# EasyEDA Pro project USB_FLARM_UPDATER.eprj, board PCB1
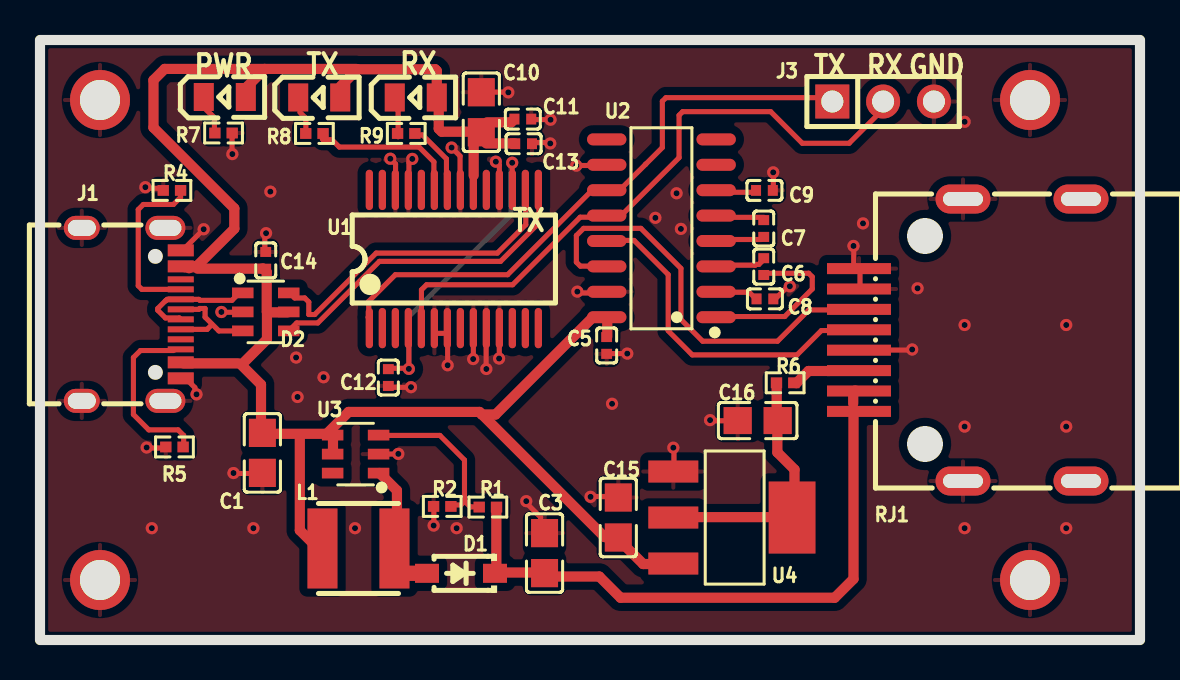
[diagram p1: board, top side]
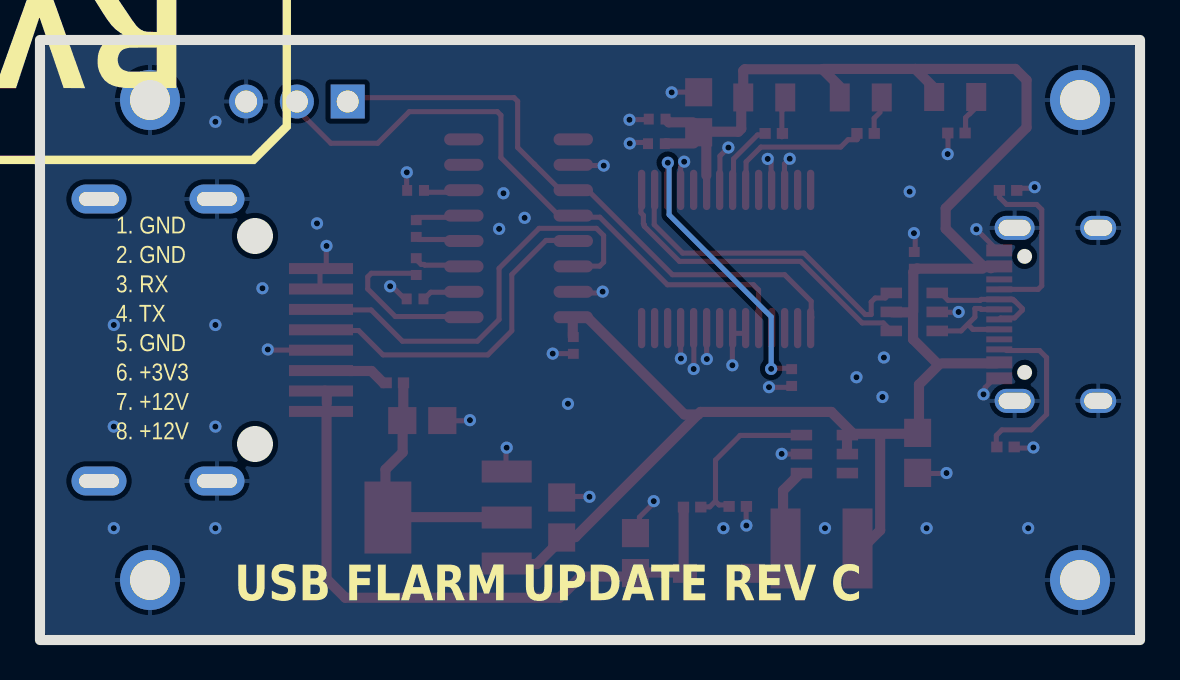
[diagram p2: board, bottom side, seen from below]

Outline 55 x 30 mm; copper layers: Top Layer, Bottom Layer. Coordinates in mm from the lower left corner of the outline.
Outline path: rectangle 0,30 55,0
Stack: Top Layer 0.035mm / Dielectric1 1.51mm FR4 er 4.5 / Bottom Layer 0.035mm

## Design rules (mm)
net VUSB: Power
net V12_OUT: Power_12V
net UD+: DP1
net UD-: DP1
net UD_IN+: DP2
net UD_IN-: DP2
template: Custom Config
spacing copperThickness1oz (default): track to track 0.102, other pairs 0.152 to 0.3
spacing copperThickness2oz: track to track 0.203, other pairs 0.152 to 0.3
track width copperThickness1oz (default): min 0.127, default 0.254, max 2.54
track width copperThickness2oz: min 0.203, default 0.254, max 2.54
track width min20mil: min 0.508, default 0.508, max 2.54
track width min15mil: min 0.381, default 0.381, max 2.54
differential pair differentialPair (default): width min 0.127, default 0.254, max 2.54; gap min 0.152, default 0.152
via viaSize (default): diameter min 0.5, default 0.61, max 10; hole min 0.3, default 0.305, max 6.3
net class Power uses min20mil
net class Power_12V uses min15mil
net VUSB uses min20mil
net V12_OUT uses min15mil

## Placement (name value [footprint] x y rotation side)
C1  22uF  [C0805]  11.12 9.36 270 top
C3  22uF  [C0805]  25.23 4.34 90 top
C5  100nF  [C0402]  28.33 14.73 90 top
C6  100nF  [C0402]  36.19 18.67 90 top
C7  100nF  [C0402]  36.19 20.57 90 top
C8  100nF  [C0402]  36.25 17.06 0 top
C9  100nF  [C0402]  36.22 22.48 0 top
C10  4.7uF  [C0805]  22.07 26.39 270 top
C11  100nF  [C0402]  24.14 26.05 180 top
C12  100nF  [C0402]  17.42 13.12 270 top
C13  100nF  [C0402]  24.18 24.81 180 top
C14  100nF  [C0402]  11.29 18.98 90 top
C15  22uF  [C0805]  28.91 6.13 270 top
C16  22uF  [C0805]  35.88 10.97 0 top
D1  B5819W SL  [SOD-123_L2.7-W1.6-LS3.7-RD-1]  21.05 3.33 180 top
D2  USBLC6-2SC6  [SOT-23-6_L2.9-W1.6-P0.95-LS2.8-BL]  11.29 16.4 270 top
J1  TYPE-C-31-M-12  [USB-C_SMD-TYPE-C-31-M-12_1]  4.56 16.28 270 top
J3  -  [HDR-TH_3P-P2.54-V-M]  42.16 26.92 0 top
L1  22uH  [IND-SMD_L4.0-W4.0_LQH44PN2R2MP0L]  15.92 4.58 180 top
LED1  KT-0805G  [LED0805-R-RD]  9.24 27.15 0 top
LED2  KT-0805Y  [LED0805-R-RD]  13.96 27.13 0 top
LED3  KT-0805Y  [LED0805-R-RD]  18.79 27.13 0 top
NOREF  -  [Pad_e1500]  49.5 3 0 top
NOREF#2  -  [Pad_e961]  3 3 0 top
NOREF#3  -  [Pad_e1501]  49.5 27 0 top
NOREF#4  -  [Pad_e752]  3 27 0 top
R1  100kΩ  [R0402]  22.39 6.65 0 top
R2  5.1kΩ  [R0402]  20.11 6.68 0 top
R4  5.1kΩ  [R0402]  6.6 22.48 0 top
R5  5.1kΩ  [R0402]  6.72 9.65 0 top
R6  10Ω  [R0402]  37.26 12.86 0 top
R7  680Ω  [R0402]  9.18 25.35 0 top
R8  680Ω  [R0402]  13.72 25.33 0 top
R9  680Ω  [R0402]  18.31 25.33 0 top
RJ1  RJ-064-1  [CONN-SMD_RJ-064]  46.5 15 90 top
U1  FT232RL-REEL  [SSOP-28_L10.2-W5.3-P0.65-LS7.8-BL]  20.69 19.05 0 top
U2  MAX3232CSE+T  [SOIC-16_L9.9-W3.9-P1.27-LS6.0-BL]  31.07 20.59 90 top
U3  MT3608  [SOT-23-6_L2.9-W1.6-P0.95-LS2.8-BL]  15.78 9.3 90 top
U4  AMS1117-3.3  [SOT-223-3_L6.5-W3.4-P2.30-LS7.0-BR]  34.63 6.12 180 top

## Footprints (pads in the part's own frame, mm; a bottom-side part is the same pattern mirrored in y, then rotated)
C0402
  rect 0.5x0.54 smd: 1(-0.42,0) 2(0.42,0)
C0805
  rect 1.41x1.35 smd: 1(-1,0) 2(1,0)
CONN-SMD_RJ-064
  rect 0.55x3.2 smd: 1(3.57,5.55) 2(2.55,5.55) 3(1.53,5.55) 4(0.51,5.55) 5(-0.51,5.55) 6(-1.53,5.55) 7(-2.55,5.55) 8(-3.57,5.55)
  oval 1.45x2.75 hole 0.7x2: 9(7.05,0.35) 10(-7.05,0.35) 11(7.05,-5.55) 12(-7.05,-5.55)
HDR-TH_3P-P2.54-V-M
  rect 1.7x1.7 hole 1.1: 1(-2.54,0)
  round 1.7 hole 1.1: 2(0,0) 3(2.54,0)
IND-SMD_L4.0-W4.0_LQH44PN2R2MP0L
  rect 1.5x4 smd: 1(-1.8,0) 2(1.8,0)
LED0805-R-RD
  rect 1x1.399 smd: 1(1.05,0) 2(-1.05,0)
Pad_e752
  round 3 hole 2: 1(0,0)
Pad_e961
  round 3 hole 2: 1(0,0)
Pad_e1500
  round 3 hole 2: 1(0,0)
Pad_e1501
  round 3 hole 2: 1(0,0)
R0402
  rect 0.566x0.54 smd: 1(-0.433,0) 2(0.433,0)
SOD-123_L2.7-W1.6-LS3.7-RD-1
  rect 1.2x0.95 smd: 1(-1.7,0) 2(1.7,0)
SOIC-16_L9.9-W3.9-P1.27-LS6.0-BL
  oval 0.602x1.971 smd: 1(-4.445,-2.736) 2(-3.175,-2.736) 3(-1.905,-2.736) 4(-0.635,-2.736) 5(0.635,-2.736) 6(1.905,-2.736) 7(3.175,-2.736) 8(4.445,-2.736) 9(4.445,2.736) 10(3.175,2.736) 11(1.905,2.736) 12(0.635,2.736) 13(-0.635,2.736) 14(-1.905,2.736) 15(-3.175,2.736) 16(-4.445,2.736)
SOT-23-6_L2.9-W1.6-P0.95-LS2.8-BL
  rect 0.532x1.072 smd: 1(-0.95,-1.149) 2(0,-1.149) 3(0.95,-1.149) 4(0.95,1.149) 5(0,1.149) 6(-0.95,1.149)
SOT-223-3_L6.5-W3.4-P2.30-LS7.0-BR
  rect 2.5x1.1 smd: 1(2.97,-2.3) 2(2.97,0) 3(2.97,2.3)
  rect 2.34x3.6 smd: 4(-2.97,0)
SSOP-28_L10.2-W5.3-P0.65-LS7.8-BL
  oval 0.364x2.015 smd: 1(-4.225,-3.455) 2(-3.575,-3.455) 3(-2.925,-3.455) 4(-2.275,-3.455) 5(-1.625,-3.455) 6(-0.975,-3.455) 7(-0.325,-3.455) 8(0.325,-3.455) 9(0.975,-3.455) 10(1.625,-3.455) 11(2.275,-3.455) 12(2.925,-3.455) 13(3.575,-3.455) 14(4.225,-3.455) 15(4.225,3.455) 16(3.575,3.455) 17(2.925,3.455) 18(2.275,3.455) 19(1.625,3.455) 20(0.975,3.455) 21(0.325,3.455) 22(-0.325,3.455) 23(-0.975,3.455) 24(-1.625,3.455) 25(-2.275,3.455) 26(-2.925,3.455) 27(-3.575,3.455) 28(-4.225,3.455)
USB-C_SMD-TYPE-C-31-M-12_1
  oval 1.2x2 hole 0.8x1.6: 1(4.325,1.706) 4(-4.325,1.706)
  oval 1.2x1.8 hole 0.8x1.4: 2(4.325,-2.474) 3(-4.325,-2.474)
  custom 0.6x1.3 smd: A1B12(-3.2,2.474) A4B9(-2.4,2.474) B1A12(3.2,2.474) B4A9(2.401,2.474)
  rect 0.3x1.3 smd: A5(-1.25,2.474) A6(-0.25,2.474) A7(0.25,2.474) A8(1.25,2.474) B5(1.75,2.474) B6(0.75,2.474) B7(-0.75,2.474) B8(-1.75,2.474)

## Nets
As in the schematic, except:
GND: C1.2 C3.2 C5.1 C8.2 C9.2 C10.1 C11.1 C12.2 C13.1 C14.2 C15.1 C16.1 D2.2 J1.1 J1.2 J1.3 J1.4 J1.A1B12 J1.B1A12 J3.3 NOREF.1 NOREF#2.1 NOREF#3.1 NOREF#4.1 R2.1 R4.1 R5.1 R7.2 RJ1.1 RJ1.2 RJ1.5 RJ1.9 RJ1.10 U1.6 U1.7 U1.9 U1.10 U1.11 U1.18 U1.21 U1.25 U1.26 U2.10 U2.15 U3.2 U4.1

Pads without a net: J1 A8 B8; RJ1 11 12; U1 2 3 8 12 13 14 19 24 27 28; U2 7 8 9; U3 6

## Via types
v1: diameter 0.61, hole 0.305, Top Layer to Bottom Layer, 56 vias

## Routing (per net, layer and track width the routed paths; a pad name or vN(x,y) marks a point on that pad's centre or on a via; arc(x,y) is an arc through that point)
GND: length 34.3
  Top Layer w0.254: 9.6,24.35 9.6,25.12 9.68,25.19 ; v1(17.51,24.06) 17.78,23.8 17.78,23.16 ; 26.79,23.72 27.76,23.72 27.83,23.79 ; 22.84,23.86 22.97,23.74 22.97,23.35 ; 22.99,14.95 22.96,14.93 22.96,14.05 ; 5.4,22.59 5.94,22.59 6.07,22.45 ; 22.48,27.39 23.44,27.39 23.45,27.38 ; 42.15,14.5 43.6,14.5 43.62,14.47 ; 20.38,14.72 v1(20.38,13.74) ; 29.2,14.32 28.43,14.32 28.36,14.25 ; 17.91,9.3 17.29,9.3 17.26,9.27 ; 37.41,17.61 37.32,17.61 36.74,17.03 ; 27.57,7.22 27.62,7.17 28.83,7.17 ; 21.69,14.89 21.67,14.87 21.67,14.05 ; 18.45,12.63 17.62,12.63 17.59,12.66 ; 19.69,5.7 19.69,6.56 19.67,6.58 ; 19.76,15.37 19.8,15.33 20.32,15.33 ; 11.24,19.47 11.24,20.18 11.22,20.2 ; 9.09,16.39 9.08,16.39 ; 6.27,9.56 6.23,9.6 5.42,9.6 ; 7.74,12.45 7.74,12.62 7.31,13.05 ; 40.7,19.73 40.69,19.71 40.69,18.71 40.69,18.71 ; 25.44,24.86 25.43,24.88 24.7,24.88 ; 34.79,10.89 34.72,10.96 33.53,10.96 ; 24.27,6.9 25.03,6.14 25.03,5.57 ; v1(8.18,20.54) 7.23,19.58 7.21,19.58 ; 40.87,17.51 41,17.64 41,18.47 ; v1(20.58,24.62) 21,24.2 21,23.16 ; v1(18.61,24.05) 18.45,23.89 18.45,23.34 ; 36.67,23.37 36.67,22.53 36.64,22.5 ; 31.7,9.53 31.7,8.66 31.68,8.64 ; 11.04,8.29 11.01,8.33 9.67,8.33 ; 22.31,13.57 22.31,14.73 22.33,14.75 ; 9.16,16.42 9.19,16.39 9.93,16.39 ; 26.95,17.36 26.96,17.35 28.04,17.35 ; 25.41,25.98 25.38,26.02 24.67,26.02
  vias: v1(5.27,22.64) v1(5.33,9.63) v1(5.59,5.59) v1(7.83,12.28) v1(9.07,16.4) v1(9.62,24.3) v1(9.67,8.35) v1(10.67,5.59) v1(11.3,20.34) v1(11.52,22.42) v1(12.8,14.12) v1(12.88,12.15) v1(14.18,13.14) v1(15.75,5.59) v1(17.92,9.31) v1(18.55,12.64) v1(19.68,5.72) v1(20.83,5.59) v1(21.66,14.05) v1(22.32,13.55) v1(22.79,23.92) v1(22.95,14.07) v1(23.42,27.38) v1(24.31,6.94) v1(25.53,26.01) v1(25.51,24.83) v1(26.81,23.72) v1(26.87,17.42) v1(27.53,7.16) v1(28.6,11.81) v1(29.36,14.32) v1(30.77,21.11) v1(31.67,9.62) v1(31.83,22.34) v1(32.04,20.56) v1(33.5,10.99) v1(36.66,23.38) v1(37.49,17.69) v1(40.68,19.7) v1(41.15,20.83) v1(43.61,14.53) v1(43.88,17.59) v1(46.23,25.91) v1(46.23,15.75) v1(46.23,10.67) v1(46.23,5.59) v1(51.31,15.75) v1(51.31,10.67) v1(51.31,5.59)
V3V3: length 12.6
  Top Layer w0.508: 36.84,11.1 36.84,12.73 36.82,12.75 ; 31.74,6.14 37.66,6.14 37.73,6.07 37.73,8.52 36.87,9.38 36.87,10.61
V3V3_OUT: length 2
  Top Layer w0.508: 37.77,12.85 37.82,12.85 38.43,13.45 39.5,13.45
V12_OUT: length 30.1
  Top Layer w0.508: 40.76,12.47 40.66,12.37 40.66,11.82 ; 22.81,6.47 22.82,6.46 22.82,3.5 ; 40.67,11.23 40.67,3.05 39.74,2.11 29.03,2.11 27.97,3.17 25.54,3.17 ; 25.02,3.33 24.98,3.37 22.79,3.37
CC1: length 8.7
  Top Layer w0.254: J1.A5 5.09,17.53 4.91,17.71 4.91,21.52 5.17,21.78 6.67,21.78 7.03,22.13 7.03,22.48
CC2: length 8.4
  Top Layer w0.254: 6.68,14.47 5.02,14.47 4.67,14.12 4.67,11.28 5.44,10.51 6.91,10.51 7.18,10.23 7.18,9.78
CP1N: length 1.8
  Top Layer w0.254: 36.19,19.02 35.94,18.78 35.8,18.78 35.76,18.74 34.52,18.74
CP1P: length 7.7
  Top Layer w0.254: 36.33,18.37 36.36,18.34 38.43,18.34 38.61,18.16 38.61,17.55 37.24,16.17 34.42,16.17
CP2N: length 1.8
  Top Layer w0.254: 36.2,21.13 34.58,21.13 34.47,21.24
CP2P: length 1.6
  Top Layer w0.254: 34.52,20.01 34.53,20.03 36.07,20.03
FB: length 8.4
  Top Layer w0.254: 16.86,10.23 19.99,10.23 21.22,9 21.22,6.93 21.04,6.75 20.6,6.75 ; 21.24,6.93 21.51,6.66 21.87,6.66
FT_3V3: length 15.4
  Top Layer w0.254: v1(18.44,13.56) 18.44,14.75 ; v1(23.61,23.86) 23.61,23.24 23.58,23.21 ; 18.41,13.59 17.42,13.59 17.38,13.54
  Bottom Layer w0.254: v1(18.44,13.56) 18.44,16.16 23.54,21.26 23.54,23.8 v1(23.61,23.86)
LED1_K: length 1.7
  Top Layer w0.254: 7.94,26.88 8.52,26.3 ; 8.72,25.46 8.72,26.12 8.53,26.31
LED2_K: length 1.3
  Top Layer w0.254: 12.99,26.39 13.29,26.09 13.29,25.24
LED3_K: length 1.4
  Top Layer w0.254: 17.86,26.51 17.91,26.46 17.91,25.16
RS232_RX: length 15.4
  Top Layer w0.254: 28.94,19.98 29.7,19.98 31.41,18.27 31.41,15.48 ; 31.41,15.46 32.61,14.25 37.85,14.25 39.07,15.47 39.43,15.47 39.52,15.38 39.7,15.38 39.78,15.46
RS232_TX: length 20.1
  Top Layer w0.254: 27.56,18.69 27.53,18.69 27.53,18.69 27.01,18.69 26.82,18.89 26.82,20.22 27.18,20.58 30.05,20.58 32.05,18.58 32.05,16.03 33.13,14.94 36.88,14.94 38.44,16.5 40.09,16.5 40.16,16.44
RXLED: length 2.8
  Top Layer w0.254: 20.32,23.26 20.32,24.05 19.12,25.25 18.84,25.25
SW: length 4.3
  Top Layer w0.508: 17.85,5.76 17.85,7.47 16.97,8.35
  Top Layer w0.762: 17.75,3.34 19.04,3.34 19.1,3.28
TXLED: length 6.6
  Top Layer w0.254: 19.68,23.39 19.69,23.4 19.69,23.91 18.95,24.65 14.97,24.65 14.6,25.02 14.15,25.02 14.12,25.05
UART_RX: length 30.1
  Top Layer w0.254: 19.04,15.7 19.07,15.74 19.07,17.51 19.33,17.76 23.63,17.76 27.01,21.14 27.63,21.14 ; 42.16,26.55 42.16,26.54 40.46,24.84 38.12,24.84 36.53,26.42 32.13,26.42 31.95,26.24 31.95,24.12 29.04,21.2 28.68,21.2
UART_TX: length 27.4
  Top Layer w0.254: 16.4,16.13 16.44,16.17 16.44,16.94 17.77,18.26 23.38,18.26 27.54,22.43 27.54,22.46 ; 30.26,23.76 30.29,23.8 ; 30.29,23.8 31.12,24.62 31.12,26.94 31.3,27.12 38.92,27.12 38.92,26.97 ; 30.29,23.8 29.14,22.65 29.14,22.61
UD+: length 16.4
  Top Layer w0.254: U1.15 24.92,22.49 24.95,22.45 24.95,21.36 24.83,21.24 24.83,20.81 24.79,20.77 24.79,20.69 23.03,18.93 16.97,18.93 13.89,15.85 12.84,15.85 D2.4
UD-: length 16.3
  Top Layer w0.254: D2.6 12.48,17.35 12.73,17.1 13.24,17.1 13.44,16.9 13.44,16.27 13.74,16.27 16.81,19.34 22.87,19.34 24.29,20.77 24.29,22.48 U1.16
UD_IN+: length 5.5
  Top Layer w0.254: J1.B6 8.36,15.53 8.58,15.76 ; J1.A6 7.94,16.53 7.99,16.58 8.24,16.58 8.25,16.57 8.25,16.14 8.94,15.45 D2.3
UD_IN-: length 5.5
  Top Layer w0.254: J1.A7 6.97,16.1 6.27,16.1 5.89,16.49 5.89,16.58 6.27,16.96 6.28,16.96 6.36,17.03 6.48,17.03 ; D2.1 9.97,17.35 9.6,16.98 7.99,16.98 7.94,17.03 J1.B7
VS_NEG: length 1.2
  Top Layer w0.254: 34.58,22.39 34.59,22.39 35.79,22.39
VS_POS: length 1.5
  Top Layer w0.254: 34.47,17.39 35.46,17.39 35.82,17.03
VUSB: length 92.6
  Top Layer w0.508: 11.15,18.58 11.34,18.39 11.34,16.43 ; 15.04,27.7 15.88,28.54 19.76,28.54 19.84,28.46 19.84,27.13 ; 23.72,24.82 23.72,24.83 22.32,24.83 ; 12.39,16.38 11.36,16.38 ; 14.65,10.17 14.65,9.33 ; 7.17,13.83 9.91,13.83 ; 11.05,10.61 11.05,12.77 10.04,13.78 ; 14.42,10.39 15.43,11.4 21.98,11.4 22.1,11.28 ; 11.15,18.57 7.88,18.57 ; 22.1,11.28 28.23,5.15 28.79,5.15 ; 22.1,11.28 22.09,11.28 ; 22.1,11.28 22.78,11.28 27.59,16.09 ; 21.7,25.46 21.66,25.41 20.09,25.41 19.94,25.56 19.94,26.96 ; 10.19,13.88 11.35,15.03 11.35,16.39 ; 22.35,25.88 23.56,25.88 23.69,26.02 ; 13.91,4.57 12.99,5.48 12.99,10.24 ; 7.24,18.64 7.87,18.71 9.72,20.56 9.72,21.58 5.67,25.62 5.67,27.99 6.23,28.55 11.19,28.55 ; 21.68,23.23 21.68,24.77 21.67,24.79 ; 28.36,15.17 28.36,16.01 ; 11.3,10.31 14.49,10.31 ; 10.39,27.7 11.24,28.55 15.81,28.55 ; 7.45,18.59 7.4,18.64 ; 31.31,3.8 30.16,3.8 28.95,5

## Copper pours and planes (outline as drawn; the poured copper is in the pictures)
GND on Top Layer: -0.12,29.95 55.16,29.95 55.16,-0.04 -0.12,-0.04
GND on Bottom Layer: -0.38,30.23 55.06,30.23 55.06,-0.28 -0.38,-0.28

## Text on the board
Bottom Silkscreen Layer: 1. GND / 2. GND / 3. RX / 4. TX / 5. GND / 6. +3V3 / 7. +12V / 8. +12V | USB FLARM UPDATE REV C
Top Silkscreen Layer: TX | RX | GND | PWR
